# Altium schematic sheet Main.SchDoc
size Letter; DocumentNumber: 1; SheetNumber: 1; SheetTotal: 9
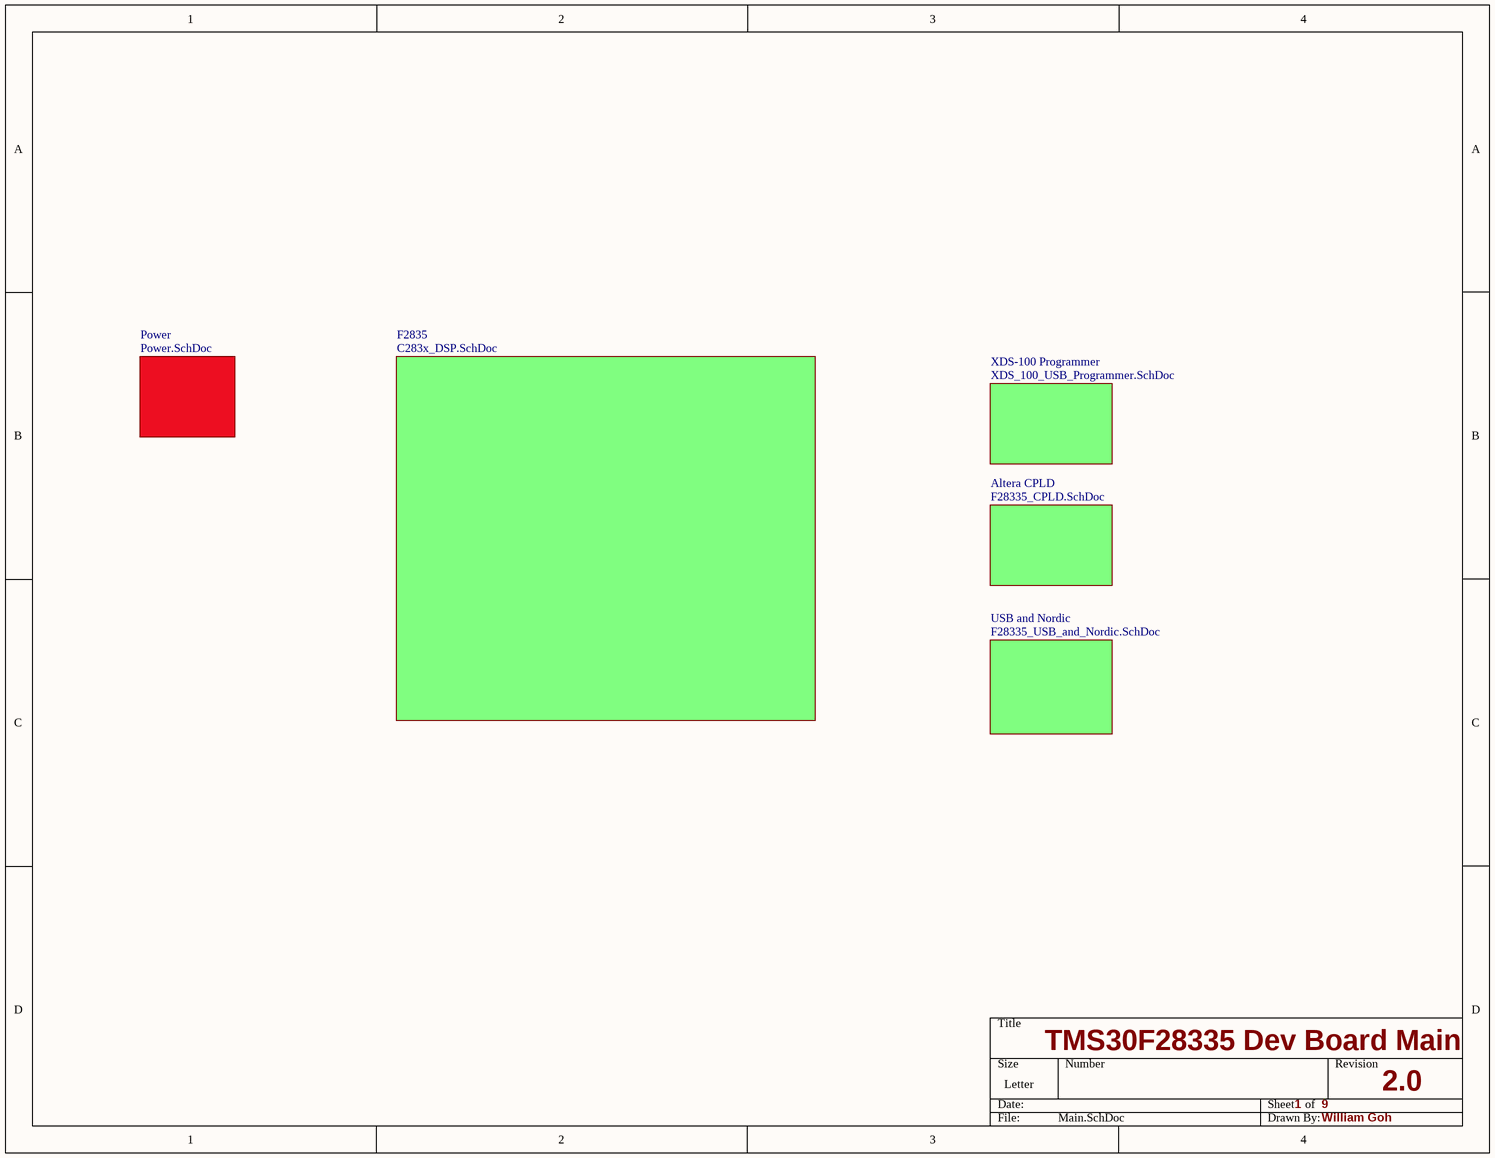
[diagram p0: Main.SchDoc]

## Sub-sheets
Altera CPLD = F28335_CPLD.SchDoc: no entries
F2835 = C283x_DSP.SchDoc: no entries
Power = Power.SchDoc: no entries
USB and Nordic = F28335_USB_and_Nordic.SchDoc: no entries
XDS-100 Programmer = XDS_100_USB_Programmer.SchDoc: no entries

## Notes on the sheet
- TMS30F28335 Dev Board Main
- 2.0
- William Goh